# Altium project nixie-tube.PrjPcb
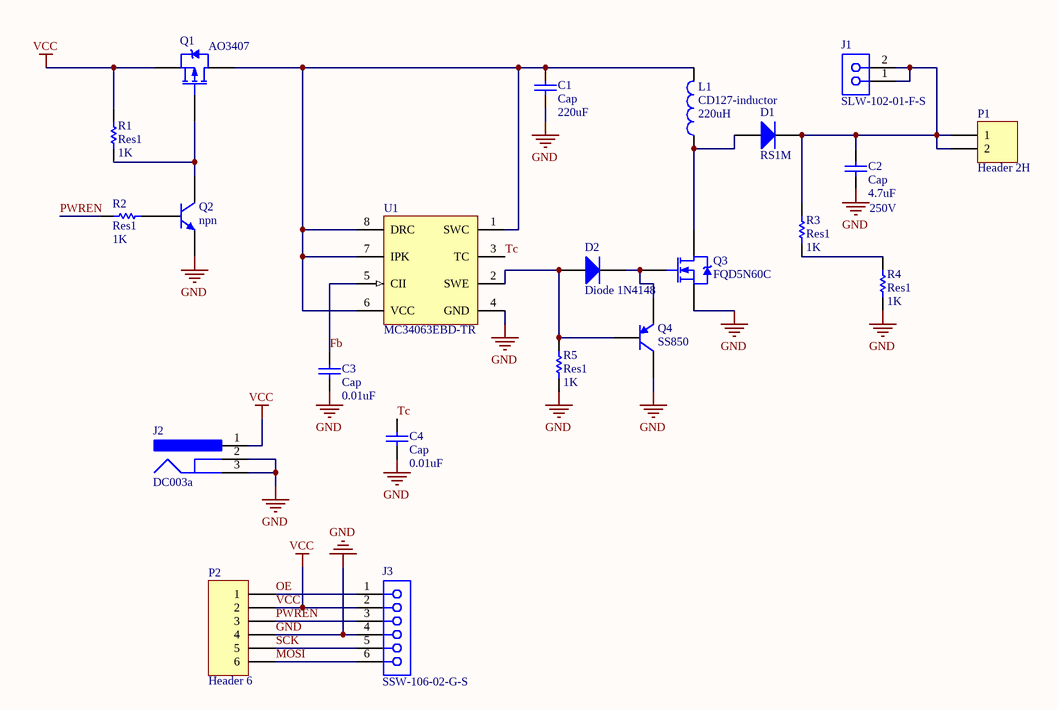
[diagram p0: nixie-tube-power.SchDoc]
1 sheet, 22 parts. Net scope: global (net labels, ports and power ports of the same name join across sheets).
Board file: nixie-tube-power.PcbDoc

## Sheet nixie-tube-power.SchDoc
size A4

### Parts
C1  Cap  value 220uF  [220uF-35V-smd]
C2  Cap  value 4.7uF  Voltage: 250V  [RB5-10.5]
C3  Cap  value 0.01uF  [1608[0603]]
C4  Cap  value 0.01uF  [1608[0603]]
D1  RS1M  [DIOD-SMA-2_A_V]
D2  Diode 1N4148  [SODFL350X110-2N]
J1  SLW-102-01-F-S  [SMTC-SLW-102-01-X-S]
J2  DC003a  [dc003a]
J3  SSW-106-02-G-S  [SMTC-SSW-106-02-X-S]
L1  CD127-inductor  value 220uH  [cd127-220uH]
P1  Header 2H  [HDR1X2H]
P2  Header 6  [HDR1X6]
Q1  AO3407  [SOT23_M]
Q2  npn  [SOT-23_M]
Q3  FQD5N60C  [SC_TO-252AA]
Q4  SS850  [SOT-23_M]
R1  Res1  value 1K  [J1-0603]
R2  Res1  value 1K  [J1-0603]
R3  Res1  value 1K  [J1-0603]
R4  Res1  value 1K  [J1-0603]
R5  Res1  value 1K  [J1-0603]
U1  MC34063EBD-TR  [SO8_M]

### Nets
GND: C1.1 C2.1 C3.1 C4.1 J2.2 J2.3 J3.4 P2.4 Q2.1(E) Q3.3(S) Q4.3(C) R4.1 R5.1 U1.4(GND)
VCC: J2.1 J3.2 P2.2 Q1.3(S) R1.2
Fb: C3.2 U1.5(CII)
MOSI: J3.6 P2.6
OE: J3.1 P2.1
PWREN: J3.3 P2.3 R2.2
SCK: J3.5 P2.5
Tc: C4.2 U1.3(TC)
NetC1_2: C1.2 L1.2 Q1.2(D) U1.1(SWC) U1.6(VCC) U1.7(IPK) U1.8(DRC)
NetC2_2: C2.2 D1.2(K) J1.1 J1.2 P1.1 P1.2 R3.2
NetD1_1: D1.1(A) L1.1 Q3.2(D)
NetD2_1: D2.1(A) Q4.2(B) R5.2 U1.2(SWE)
NetD2_2: D2.2(K) Q3.1(G) Q4.1(E)
NetQ1_1: Q1.1(G) Q2.3(C) R1.1
NetQ2_2: Q2.2(B) R2.1
NetR3_1: R3.1 R4.2

### Library data of the parts
C1-C4 = Cap: Capacitor; Published: 8-Jun-2000; LatestRevisionDate: 17-Jul-2002; LatestRevisionNote: Re-released for DXP Platform.; PackageReference: RAD-0.3; Publisher: Altium Limited; PackageDescription: Radial Cap, Thru-Hole; 2 Leads; 0.3 in Pin Spacing
  C1: PurchaseLink: https://world.taobao.com/item/537495926937.htm
  C2: PurchaseLink: https://world.taobao.com/item/525902443723.htm
  C3 C4: PurchaseLink: https://world.taobao.com/item/525960892359.htm
D1 = CMP-1667-00001-4: Ultra-Fast Rectifier, 1 A, 1.7 V, -65 to 150 degC, 2-Pin SMD, RoHS, Tape and Reel; Manufacturer: Diodes Inc; ComponentLink2Description: Datasheet; PackageDescription: 2-Pin Surface Mount Device, Body 4.3 x 2.605 mm; Height: 2.1 mm; REACH SVHC: Yes; RoHSCompliant: true; Min Operating Temperature: -65 degC; Pins: 2; Packaging: Cut Tape; ComponentLink2URL: http://www.diodes.com/_files/datasheets/ds16008.pdf; Package Quantity: 1; Length: 4.6 mm; Max Operating Temperature: 150 degC; ComponentLink1URL: http://www.diodes.com/; ComponentLink1Description: Manufacturer URL; DatasheetVersion: Rev. 11-2, 12/2014; PackageReference: SMA-2; Mount: Surface Mount; Mounting Technology: Surface Mount; PurchaseLink: https://world.taobao.com/item/526206815649.htm
D2 = Diode 1N4148: High Conductance Fast Diode; Published: 8-Jun-2000; LatestRevisionDate: 17-Jul-2002; LatestRevisionNote: Re-released for DXP Platform.; DatasheetVersion: 1997; PackageReference: DO-35; Publisher: Altium Limited; PackageDescription: Diode, Axial; Body 3.8 x 1.9 mm (LxDia. max), Lead Dia. 0.53 mm (max); Code_JEDEC: DO-204-AH; ComponentLink1Description: Manufacturer Link; ComponentLink1URL: http://www.fairchildsemi.com/; ComponentLink2Description: Datasheet; ComponentLink2URL: http://www.fairchildsemi.com/ds/1N%2F1N4148.pdf; PurchaseLink: https://world.tmall.com/item/547099216928.htm
J1 = CMP-1023-00122-1: Low Profile Socket Strips, Through-hole, Vertical, -55 to 125 degC, 2.54 mm Pitch, 2-Pin, Female, RoHS; Manufacturer: Samtec; Pitch: 2.54 mm; Temperature Range: -55 to 125 degC; DatasheetVersion: F-214; Orientation: Vertical; RoHS: True; PartNumber: SLW-102-01-F-S; ComponentLink1Description: Manufacturer URL; ComponentLink1URL: http://www.samtec.com; PackageVersion: X, 9/1987; ComponentLink3Description: Package Specification; PackageDescription: Low Profile Socket Strip; ComponentLink2URL: http://www.samtec.com/documents/webfiles/pdf/SLW.PDF; ComponentLink2Description: Datasheet; ComponentLink3URL: http://www.samtec.com/documents/webfiles/cpdf/SLW-1XX-01-X-X-MKT.pdf; Mounting Technology: Through-hole; PackageReference: SLW-102-01-X-S
J2 = CMP-2000-06895-1: Through Hole Right Angle DC Power Jack, 2.5 A, 2 mm Center Pin, 3 Position, -25 to 85 degC, RoHS, Bulk; Manufacturer: CUIInc.; Current Rating: 2.5A; Inside Contact Diameter: 2mm; Insulation Resistance: 50MOhms; Outside Contact Diameter: 6.5mm; Voltage Rating: 24V; Brand: CUI; Operating Temperature Range: -25Cto+85C; Mounting Technology: ThroughHole; Connector Type: DCPowerJack; Contact Material: Copper; Datasheet URL: http://www.cui.com/product/resource/pj-002a.pdf; Contact Gender: Male; Housing Material: PolybutyleneTerephthalate(PBT); Manufacturer URL: http://www.cui.com/; Package Reference: PJ-002A; Mounting Style: ThroughHole; Mounting Angle: Right; Product Category: DCPowerConnectors; Product: Jacks; Flammability Rating: UL94V-0; Contact Plating: Nickel; RoHS: True; Datasheet Version: Rev. 1.03, 04/2016; Package Description: 3-Pin Through Hole Device, Body 14.4 x 9 mm, Height 11 mm; Factory Pack Quantity: 500; Termination Style: ThroughHole
J3 = CMP-1023-00359-1: SQ Post Socket, Through-hole, Vertical, -55 to 125 degC, 2.54mm Pitch, 6-Pin, Female, RoHS; Manufacturer: Samtec; ComponentLink1Description: Manufacturer URL; Pitch: 2.54 mm; ComponentLink1URL: http://www.samtec.com; ComponentLink2Description: Datasheet; PackageVersion: CA, 6/1987; Orientation: Vertical; RoHS: True; PackageReference: SSW-106-02-X-S; ComponentLink2URL: http://www.samtec.com/documents/webfiles/pdf/SSW_TH.PDF; Mounting Technology: Through-hole; Temperature Range: -55 to 125 degC; PackageDescription: Assembly, Socket Strip .016 X .031 Tail; DatasheetVersion: F-214; ComponentLink3Description: Package Specification; PartNumber: SSW-106-02-G-S; ComponentLink3URL: http://www.samtec.com/documents/webfiles/cpdf/SSW-1XX-XX-XXX-X-XX-XXX-XX-MKT.pdf
L1 = Inductor: Code_IEC: 1005; Published: 8-Jun-2000; LatestRevisionDate: 29-May-2009; LatestRevisionNote: IPC-7351 Footprint Added.; PackageReference: 0402-A; Publisher: Altium Limited; PackageDescription: Chip Inductor; Code_JEITA: 0402; PurchaseLink: https://world.taobao.com/item/555745401299.htm
P1 = Header 2H: Header, 2-Pin, Right Angle; LatestRevisionDate: 17-Jul-2002; LatestRevisionNote: Re-released for DXP Platform.; Publisher: Altium Limited
P2 = Header 6: Header, 6-Pin; LatestRevisionDate: 17-Jul-2002; LatestRevisionNote: Re-released for DXP Platform.; Publisher: Altium Limited
Q1 = PMOS-2: P-Channel Power MOSFET; Note: Pin 4 not drawn and electrically connected to Pin 2.; Published: 8-Jun-2000; LatestRevisionDate: 17-Jul-2002; LatestRevisionNote: Re-released for DXP Platform.; DatasheetVersion: PD-9.390D; PackageVersion: Feb-1997; PackageReference: TO-220AB; Publisher: Altium Limited; PackageDescription: TO, Thru-Hole, Vertical, Heatsink Mounted; 3 In-Line Leads; Pitch 2.54 mm; ComponentLink1Description: Manufacturer Link; ComponentLink1URL: https://world.taobao.com/item/536175949073.htm; PurchaseLink: https://world.taobao.com/item/536175949073.htm
Q2 = 2N3904: NPN General Purpose Amplifier; Published: 8-Jun-2000; LatestRevisionDate: 15-Jan-2003; LatestRevisionNote: PCB Footprint 'BCY-W3/D4.7' replaced; DatasheetVersion: 1997; PackageVersion: Sep-1998; PackageReference: TO-92A; Publisher: Altium Limited; PackageDescription: TO, Flat Index; 3 In-Line, Axial Leads; Body Dia. 4.5mm; Leads 0.51 x 0.48 mm (max); ComponentLink1Description: Manufacturer Link; ComponentLink1URL: http://www.fairchildsemi.com/; ComponentLink2Description: Datasheet; ComponentLink2URL: http://www.fairchildsemi.com/ds/2N%2F2N3904.pdf
Q3 = NMOS-2: N-Channel Power MOSFET; Note: Pin 2 is electrically connected to pin 4.; Published: 8-Jun-2000; LatestRevisionDate: 17-Jul-2002; LatestRevisionNote: Re-released for DXP Platform.; DatasheetVersion: PD-9.814; PackageVersion: Feb-1997; PackageReference: TO-220AB; Publisher: Altium Limited; PackageDescription: TO, Thru-Hole, Vertical, Heatsink Mounted; 3 In-Line Leads; Pitch 2.54 mm; ComponentLink1Description: Manufacturer Link; ComponentLink1URL: http://www.irf.com/; PurchaseLink: https://world.tmall.com/item/44219312542.htm
Q4 = 2N3906: PNP General Purpose Amplifier; pin to pad: 1>2 2>1; Published: 8-Jun-2000; LatestRevisionDate: 15-Jan-2003; LatestRevisionNote: PCB Footprint 'BCY-W3/D4.7' replaced; DatasheetVersion: 1997; PackageVersion: Sep-1998; PackageReference: TO-92A; Publisher: Altium Limited; PackageDescription: TO, Flat Index; 3 In-Line, Axial Leads; Body Dia. 4.5mm; Leads 0.51 x 0.48 mm (max); ComponentLink1Description: Manufacturer Link; ComponentLink1URL: http://www.fairchildsemi.com/; ComponentLink2Description: Datasheet; ComponentLink2URL: http://www.fairchildsemi.com/ds/2N%2F2N3906.pdf; PurchaseLink: https://world.taobao.com/item/525943897429.htm
R1-R5 = Res1: Resistor; Published: 8-Jun-2000; LatestRevisionDate: 17-Jul-2002; LatestRevisionNote: Re-released for DXP Platform.; PackageReference: AXIAL-0.3; Publisher: Altium Limited; PackageDescription: Axial Device, Thru-Hole; 2 Leads; 0.3 in Pin Spacing
U1 = CMP-0241-00013-1: DC/DC converter control circuit, 8-Pin SO, Tape and Reel; ComponentLink2URL: http://www.st.com/internet/com/TECHNICAL_RESOURCES/TECHNICAL_LITERATURE/DATASHEET/CD00001232.pdf; ComponentLink1URL: http://www.st.com; PackageVersion: Dec-2002; Code_IPC: SOIC127P600-8; PackageDescription: 8-Pin Small Outline Integrated Circuit 1.27 mm Pitch; DatasheetVersion: Nov-2007; PackageReference: SO8; ComponentLink2Description: Datasheet; ComponentLink3Description: Package Specification; ComponentLink1Description: Manufacturer URL; Code_JEDEC: MS-012-AA; ComponentLink3URL: http://www.st.com/internet/com/TECHNICAL_RESOURCES/TECHNICAL_LITERATURE/PACKAGE_INFORMATION/CD00004680.pdf